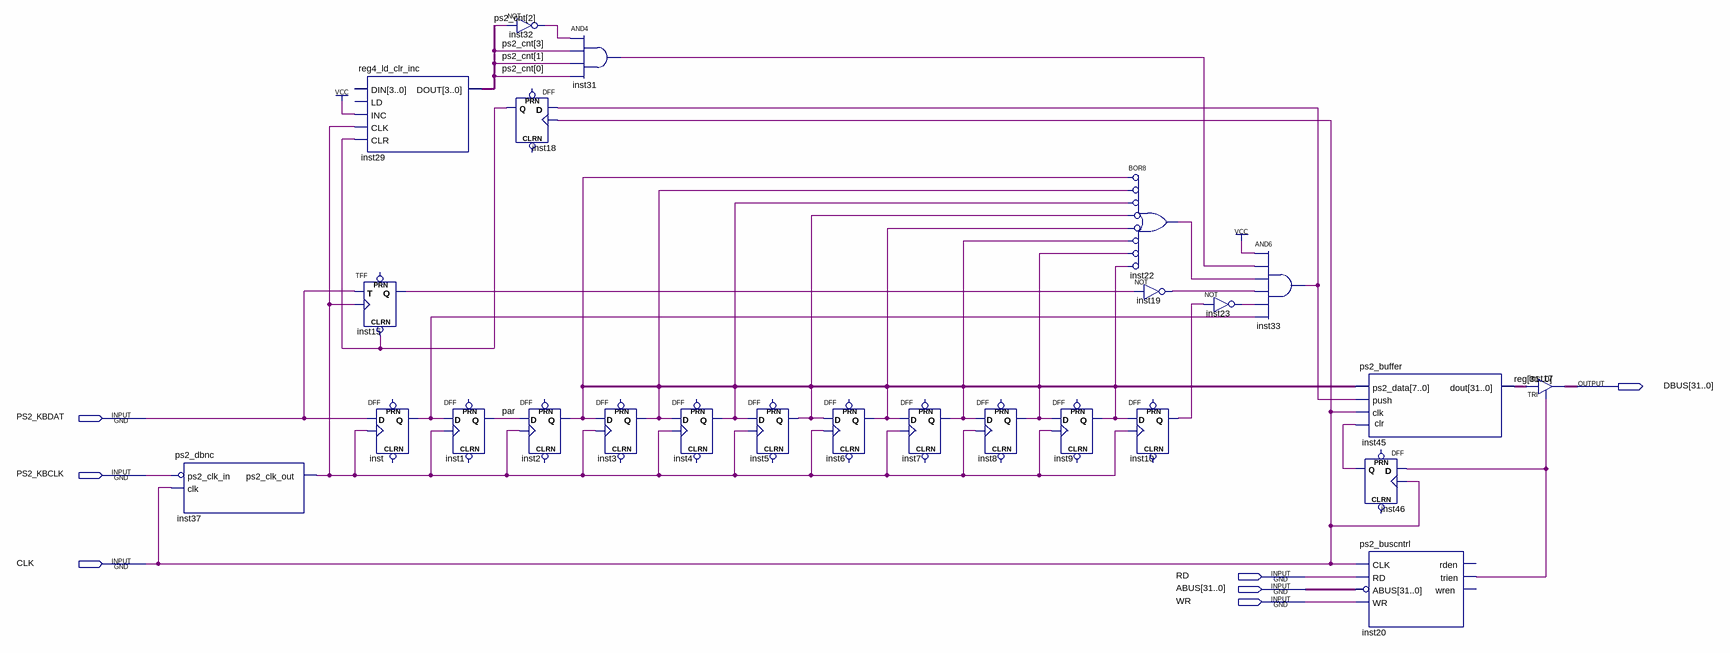
[diagram p0: schematic sheet]
// Quartus schematic ps2_controller.bdf as structural Verilog: 25 symbols, 7 pins
module ps2_controller (
  input  PS2_KBDAT,
  input  PS2_KBCLK,
  input  CLK,
  input  RD,
  input  [31:0] ABUS,
  input  WR,
  output [31:0] DBUS
);

  wire inst10_q, inst15_q, inst18_q, inst19_out, inst20_trien, inst22_out, inst23_out, inst31_out,
       inst32_out, inst33_out, inst37_ps2_clk_out, inst46_q, inst_q, par;
  wire [3:0] ps2_cnt;
  wire [7:0] data;
  wire [31:0] \reg ;

  ps2_dbnc inst37 (.clk(CLK), .ps2_clk_in(~PS2_KBCLK), .ps2_clk_out(inst37_ps2_clk_out));
  reg4_ld_clr_inc inst29 (.INC(1'b1), .CLK(inst37_ps2_clk_out), .CLR(inst18_q), .DOUT(ps2_cnt));  // open: DIN, LD
  TFF inst15 (.CLRN(inst18_q), .T(PS2_KBDAT), .CLK(inst37_ps2_clk_out), .Q(inst15_q));  // open: PRN
  DFF inst (.CLK(inst37_ps2_clk_out), .D(PS2_KBDAT), .Q(inst_q));  // open: CLRN, PRN
  DFF inst1 (.CLK(inst37_ps2_clk_out), .D(inst_q), .Q(par));  // open: CLRN, PRN
  not inst32 (inst32_out, ps2_cnt[2]);
  DFF inst18 (.CLK(CLK), .D(inst33_out), .Q(inst18_q));  // open: CLRN, PRN
  DFF inst2 (.CLK(inst37_ps2_clk_out), .D(par), .Q(data[7]));  // open: CLRN, PRN
  and inst31 (inst31_out, inst32_out, ps2_cnt[3], ps2_cnt[1], ps2_cnt[0]);
  DFF inst3 (.CLK(inst37_ps2_clk_out), .D(data[7]), .Q(data[6]));  // open: CLRN, PRN
  DFF inst4 (.CLK(inst37_ps2_clk_out), .D(data[6]), .Q(data[5]));  // open: CLRN, PRN
  DFF inst5 (.CLK(inst37_ps2_clk_out), .D(data[5]), .Q(data[4]));  // open: CLRN, PRN
  DFF inst6 (.CLK(inst37_ps2_clk_out), .D(data[4]), .Q(data[3]));  // open: CLRN, PRN
  DFF inst7 (.CLK(inst37_ps2_clk_out), .D(data[3]), .Q(data[2]));  // open: CLRN, PRN
  DFF inst8 (.CLK(inst37_ps2_clk_out), .D(data[2]), .Q(data[1]));  // open: CLRN, PRN
  DFF inst9 (.CLK(inst37_ps2_clk_out), .D(data[1]), .Q(data[0]));  // open: CLRN, PRN
  or inst22 (inst22_out, ~data[7], ~data[6], ~data[5], ~data[4], ~data[3], ~data[2], ~data[1], ~data[0]);  // BOR8
  DFF inst10 (.CLK(inst37_ps2_clk_out), .D(data[0]), .Q(inst10_q));  // open: CLRN, PRN
  not inst19 (inst19_out, inst15_q);
  not inst23 (inst23_out, inst10_q);
  and inst33 (inst33_out, 1'b1, inst31_out, inst22_out, inst19_out, inst23_out, inst_q);
  ps2_buffer inst45 (.ps2_data(data), .push(inst33_out), .clk(CLK), .clr(inst46_q), .dout(\reg ));
  DFF inst46 (.CLK(CLK), .D(inst20_trien), .Q(inst46_q));  // open: CLRN, PRN
  ps2_buscntrl inst20 (
    .ABUS(ABUS ^ 32'hfffd0000), .CLK(CLK), .RD(RD), .WR(WR), .trien(inst20_trien));  // open: rden, wren
  TRI inst17[31:0] (.IN(\reg ), .OE(inst20_trien), .OUT(DBUS));
endmodule
